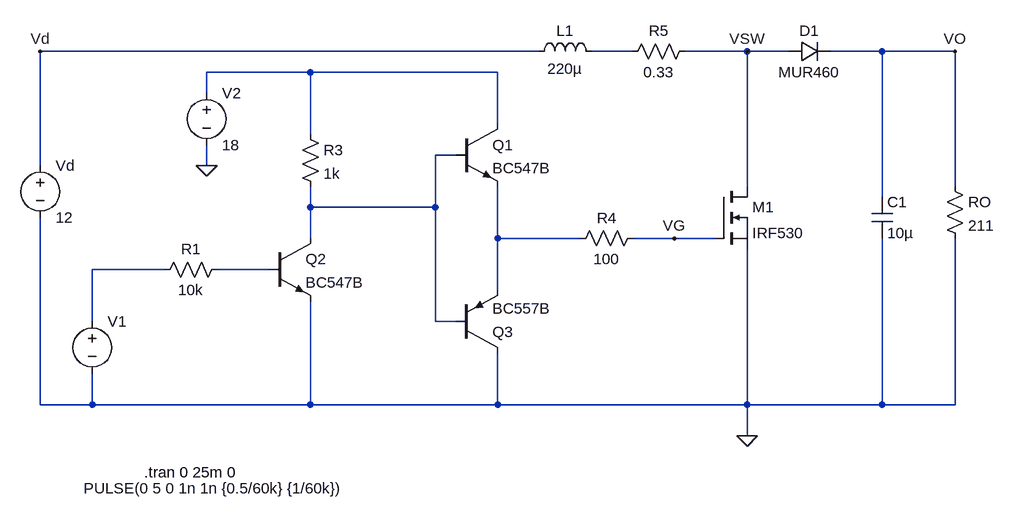
[diagram p0: schematic Circuito Ideal.asc]
Circuito Ideal.asc, the LTspice schematic file:
Version 4
SHEET 1 1896 680
WIRE 624 -144 -144 -144
WIRE 768 -144 704 -144
WIRE 944 -144 848 -144
WIRE 1008 -144 944 -144
WIRE 1152 -144 1072 -144
WIRE 1264 -144 1152 -144
WIRE 272 -112 112 -112
WIRE 560 -112 272 -112
WIRE 112 -80 112 -112
WIRE 560 -32 560 -112
WIRE 272 -16 272 -112
WIRE 496 16 464 16
WIRE -144 32 -144 -144
WIRE 112 32 112 0
WIRE 944 64 944 -144
WIRE 1264 64 1264 -144
WIRE 1152 80 1152 -144
WIRE 272 96 272 64
WIRE 464 96 464 16
WIRE 464 96 272 96
WIRE 272 144 272 96
WIRE 560 144 560 64
WIRE 688 144 560 144
WIRE 832 144 768 144
WIRE 896 144 832 144
WIRE 48 192 -64 192
WIRE 208 192 128 192
WIRE 560 224 560 144
WIRE -64 272 -64 192
WIRE 464 272 464 96
WIRE 496 272 464 272
WIRE -144 400 -144 112
WIRE -64 400 -64 352
WIRE -64 400 -144 400
WIRE 272 400 272 240
WIRE 272 400 -64 400
WIRE 560 400 560 320
WIRE 560 400 272 400
WIRE 944 400 944 160
WIRE 944 400 560 400
WIRE 1152 400 1152 144
WIRE 1152 400 944 400
WIRE 1264 400 1264 144
WIRE 1264 400 1152 400
WIRE 944 448 944 400
FLAG 1264 -144 VO
FLAG -144 -144 Vd
FLAG 832 144 VG
FLAG 944 -144 VSW
FLAG 944 448 0
FLAG 112 32 0
SYMBOL voltage -64 256 R0
WINDOW 123 0 0 Left 0
WINDOW 39 0 0 Left 0
WINDOW 3 -13 273 Left 2
SYMATTR Value PULSE(0 5 0 1n 1n {0.5/60k} {1/60k})
SYMATTR InstName V1
SYMBOL npn 496 -32 R0
SYMATTR InstName Q1
SYMATTR Value BC547B
SYMBOL npn 208 144 R0
SYMATTR InstName Q2
SYMATTR Value BC547B
SYMBOL res 256 -32 R0
SYMATTR InstName R3
SYMATTR Value 1k
SYMBOL res 672 160 R270
WINDOW 0 32 56 VTop 2
WINDOW 3 0 56 VBottom 2
SYMATTR InstName R4
SYMATTR Value 100
SYMBOL nmos 896 64 R0
SYMATTR InstName M1
SYMATTR Value IRF530
SYMBOL res 752 -128 R270
WINDOW 0 32 56 VTop 2
WINDOW 3 0 56 VBottom 2
SYMATTR InstName R5
SYMATTR Value 0.33
SYMBOL ind 608 -128 R270
WINDOW 0 32 56 VTop 2
WINDOW 3 5 56 VBottom 2
SYMATTR InstName L1
SYMATTR Value 220µ
SYMBOL diode 1008 -128 R270
WINDOW 0 32 32 VTop 2
WINDOW 3 0 32 VBottom 2
SYMATTR InstName D1
SYMATTR Value MUR460
SYMBOL cap 1136 80 R0
SYMATTR InstName C1
SYMATTR Value 10µ
SYMBOL res 1248 48 R0
SYMATTR InstName RO
SYMATTR Value 211
SYMBOL voltage -144 16 R0
WINDOW 123 0 0 Left 0
WINDOW 39 0 0 Left 0
SYMATTR InstName Vd
SYMATTR Value 12
SYMBOL pnp 496 320 M180
SYMATTR InstName Q3
SYMATTR Value BC557B
SYMBOL voltage 112 -96 R0
WINDOW 123 0 0 Left 0
WINDOW 39 0 0 Left 0
SYMATTR InstName V2
SYMATTR Value 18
SYMBOL res 32 208 R270
WINDOW 0 32 56 VTop 2
WINDOW 3 0 56 VBottom 2
SYMATTR InstName R1
SYMATTR Value 10k
TEXT 16 504 Left 2 !.tran 0 25m 0

The netlist it stands for:
* Circuito Ideal.asc
V1 N005 0 PULSE(0 5 0 1n 1n {0.5/60k} {1/60k})
Q1 N002 N003 N004 0 BC547B
Q2 N003 N006 0 0 BC547B
R3 N002 N003 1k
R4 N004 VG 100
M1 VSW VG 0 0 IRF530
R5 N001 VSW 0.33
L1 Vd N001 220µ
D1 VSW VO MUR460
C1 VO 0 10µ
RO VO 0 211
Vd Vd 0 12
Q3 0 N003 N004 0 BC557B
V2 N002 0 18
R1 N005 N006 10k
.model D D
.lib standard.dio
.model NPN NPN
.model PNP PNP
.lib standard.bjt
.model NMOS NMOS
.model PMOS PMOS
.lib standard.mos
.tran 0 25m 0
.backanno
.end